# EAGLE design cell-voltage-amplifier (EAGLE 9.5.0)
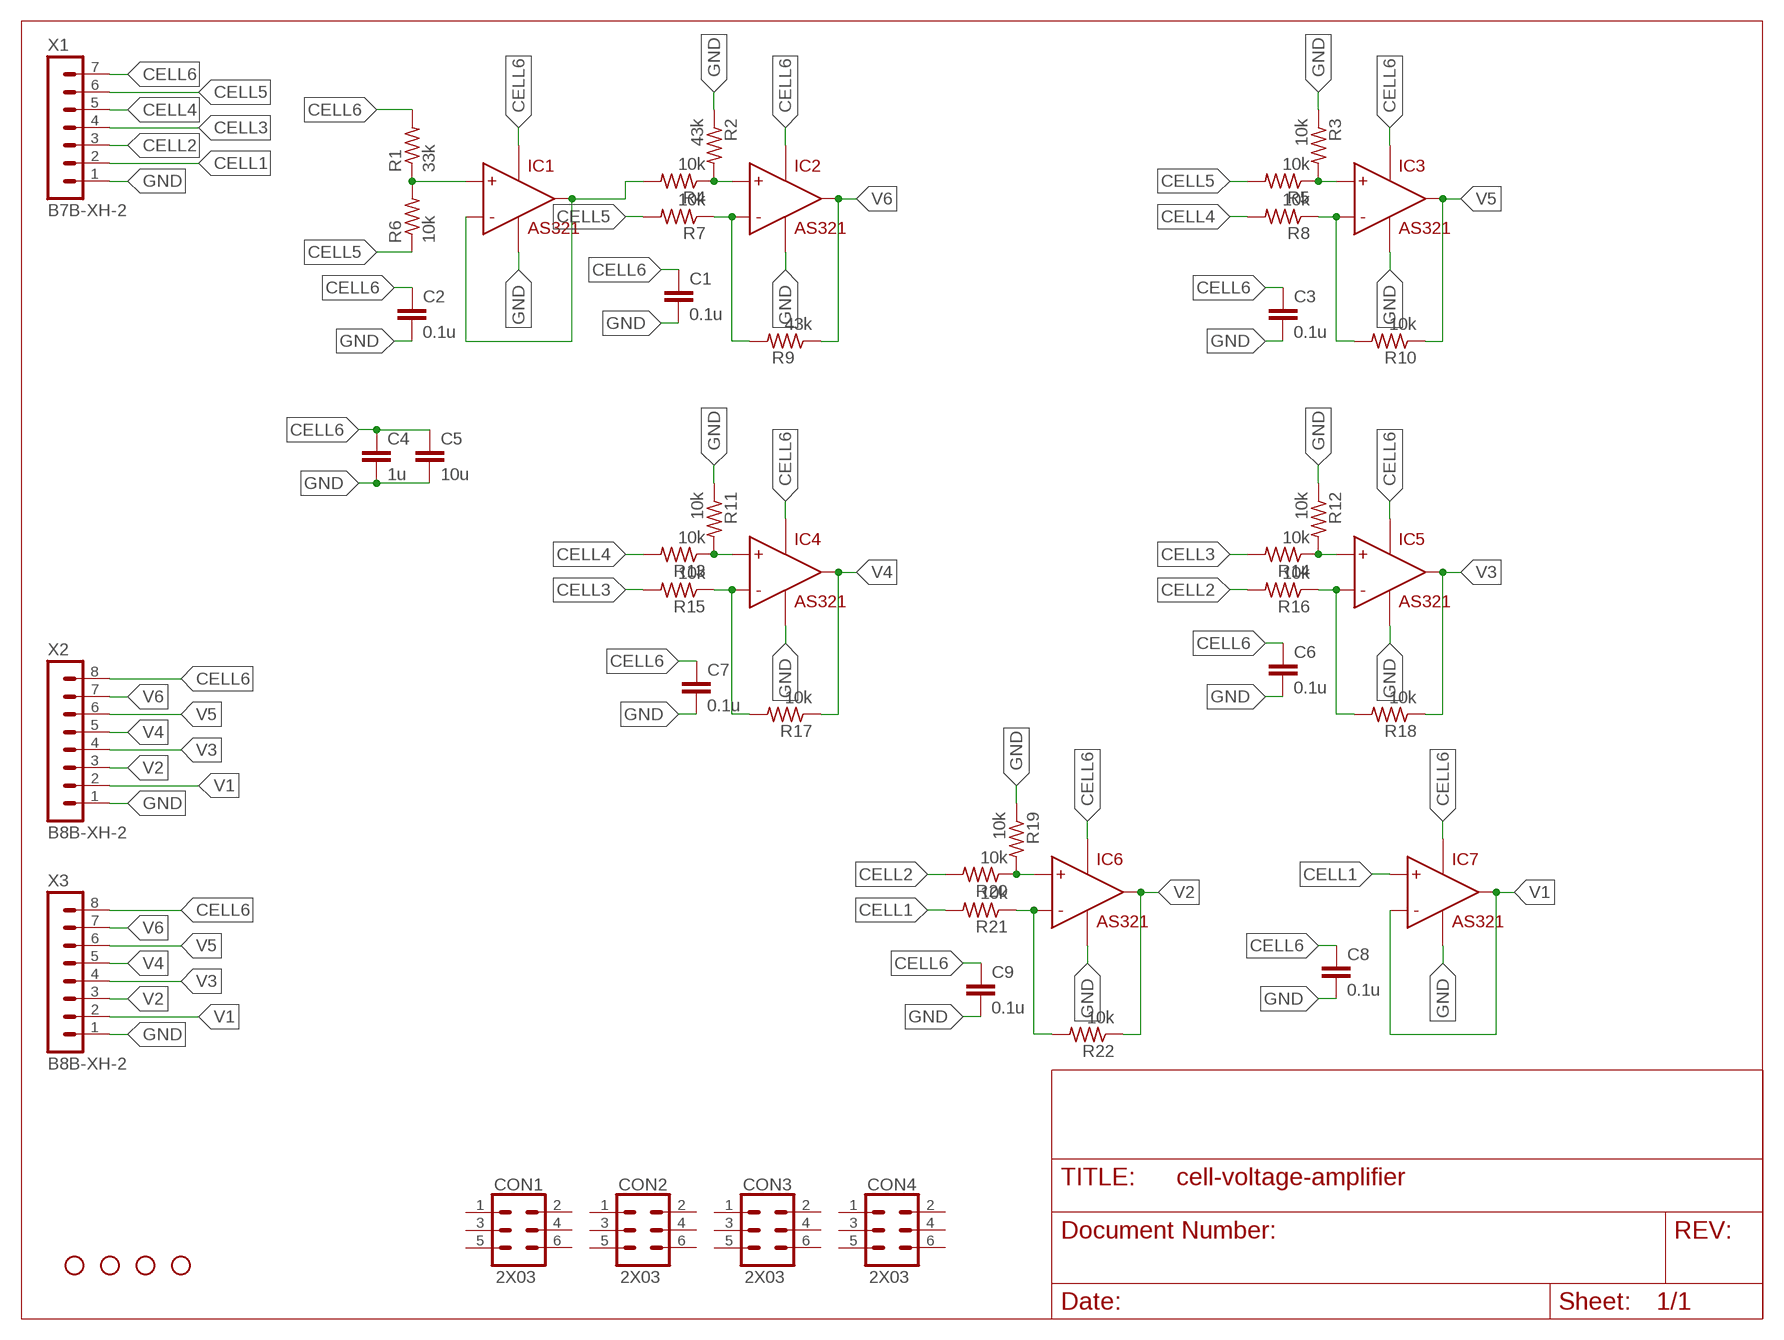
[diagram p0: schematic, sheet 1]

## Parts
C1  0.1u  CAPACITOR_0805  [0805]
C2  0.1u  CAPACITOR_0805  [0805]
C3  0.1u  CAPACITOR_0805  [0805]
C4  1u  CAPACITOR_0805  [0805]
C5  10u  CAPACITOR_0805  [0805]
C6  0.1u  CAPACITOR_0805  [0805]
C7  0.1u  CAPACITOR_0805  [0805]
C8  0.1u  CAPACITOR_0805  [0805]
C9  0.1u  CAPACITOR_0805  [0805]
CON1  2X03  [2X03]
CON2  2X03  [2X03]
CON3  2X03  [2X03]
CON4  2X03  [2X03]
H1  STAND-OFF  [STAND-OFF]
H2  STAND-OFF  [STAND-OFF]
H3  STAND-OFF  [STAND-OFF]
H4  STAND-OFF  [STAND-OFF]
IC1  AS321  [AS321]
IC2  AS321  [AS321]
IC3  AS321  [AS321]
IC4  AS321  [AS321]
IC5  AS321  [AS321]
IC6  AS321  [AS321]
IC7  AS321  [AS321]
R1  33k  R-US_R0805  [R0805]
R2  43k  R-US_R0805  [R0805]
R3  10k  R-US_R0805  [R0805]
R4  10k  R-US_R0805  [R0805]
R5  10k  R-US_R0805  [R0805]
R6  10k  R-US_R0805  [R0805]
R7  10k  R-US_R0805  [R0805]
R8  10k  R-US_R0805  [R0805]
R9  43k  R-US_R0805  [R0805]
R10  10k  R-US_R0805  [R0805]
R11  10k  R-US_R0805  [R0805]
R12  10k  R-US_R0805  [R0805]
R13  10k  R-US_R0805  [R0805]
R14  10k  R-US_R0805  [R0805]
R15  10k  R-US_R0805  [R0805]
R16  10k  R-US_R0805  [R0805]
R17  10k  R-US_R0805  [R0805]
R18  10k  R-US_R0805  [R0805]
R19  10k  R-US_R0805  [R0805]
R20  10k  R-US_R0805  [R0805]
R21  10k  R-US_R0805  [R0805]
R22  10k  R-US_R0805  [R0805]
X1  B7B-XH-2  [B7B-XH-A]
X2  B8B-XH-2  [B8B-XH-A]
X3  B8B-XH-2  [B8B-XH-A]

## Nets
CELL1: IC7.1(I+) R21.2 X1.2
CELL2: R16.2 R20.2 X1.3
CELL3: R14.2 R15.2 X1.4
CELL4: R8.2 R13.2 X1.5
CELL5: R5.2 R6.1 R7.2 X1.6
CELL6: C1.1 C2.1 C3.1 C4.1 C5.1 C6.1 C7.1 C8.1 C9.1 IC1.5(V+) IC2.5(V+) IC3.5(V+) IC4.5(V+) IC5.5(V+) IC6.5(V+) IC7.5(V+) R1.2 X1.7 X2.8 X3.8
GND: C1.2 C2.2 C3.2 C4.2 C5.2 C6.2 C7.2 C8.2 C9.2 IC1.2(V-) IC2.2(V-) IC3.2(V-) IC4.2(V-) IC5.2(V-) IC6.2(V-) IC7.2(V-) R2.1 R3.1 R11.1 R12.1 R19.1 X1.1 X2.1 X3.1
N$1: IC1.3(I-) IC1.4(OUT) R4.2
N$2: IC1.1(I+) R1.1 R6.2
N$3: IC2.1(I+) R2.2 R4.1
N$4: IC2.3(I-) R7.1 R9.2
N$6: IC4.1(I+) R11.2 R13.1
N$7: IC4.3(I-) R15.1 R17.2
N$8: IC3.1(I+) R3.2 R5.1
N$9: IC3.3(I-) R8.1 R10.2
N$12: IC5.1(I+) R12.2 R14.1
N$13: IC5.3(I-) R16.1 R18.2
N$15: IC6.1(I+) R19.2 R20.1
N$16: IC6.3(I-) R21.1 R22.2
V1: IC7.3(I-) IC7.4(OUT) X2.2 X3.2
V2: IC6.4(OUT) R22.1 X2.3 X3.3
V3: IC5.4(OUT) R18.1 X2.4 X3.4
V4: IC4.4(OUT) R17.1 X2.5 X3.5
V5: IC3.4(OUT) R10.1 X2.6 X3.6
V6: IC2.4(OUT) R9.1 X2.7 X3.7
Unconnected: CON1.1 CON1.2 CON1.3 CON1.4 CON1.5 CON1.6 CON2.1 CON2.2 CON2.3 CON2.4 CON2.5 CON2.6 CON3.1 CON3.2 CON3.3 CON3.4 CON3.5 CON3.6 CON4.1 CON4.2 CON4.3 CON4.4 CON4.5 CON4.6

## Library data of the parts
C1-C9 = EcoCar-Passives:CAPACITOR_0805
CON1-CON4 = EcoCar-Connectors-2.54mm:2X03: 2.54mm (0.1") Header
H1-H4 = EcoCar-Miscellaneous:STAND-OFF: Stand Off Drill holes for mechanically mounting via screws, standoffs, etc. Note: Use the keepout ring to avoid running the screw head into surrounding components. Variant Overviews STAND-OFF - Mechanical footprint for a #4 phillips button head screw. STAND-OFF-TIGHT - Mechanical footprint for a #4 phillips button head screw, Example SparkFun Products Screw - Phillips Head (1/4", 4-40, 10 pack) <https://www.sparkfun.com/products/10453> (PRT-10453) Screw - Phillips Head (1/2", 4-40, 10 pack) <https://www.sparkfun.com/products/10452> (PRT-10452) Screw - Phillips Head (3/4", 4-40, 10 pack) <https://www.sparkfun.com/products/10451> (PRT-10451) Screw - Phillips Head (1", 4-40, 10 pack) <https://www.sparkfun.com/products/10450> (PRT-10450)
IC1-IC7 = AS321:AS321: Digikey PArt #: AS321KTR-E1
R1-R22 = rcl:R-US_: RESISTOR, American symbol; SPICEPREFIX: R
X1 = con-JST:B7B-XH: JST XH series header 2.50mm pitch disconnectable crimp style connectors, vertical (side entry type), 7 pins
X2 X3 = con-JST:B8B-XH: JST XH series header 2.50mm pitch disconnectable crimp style connectors, vertical (side entry type), 8 pins

## Board
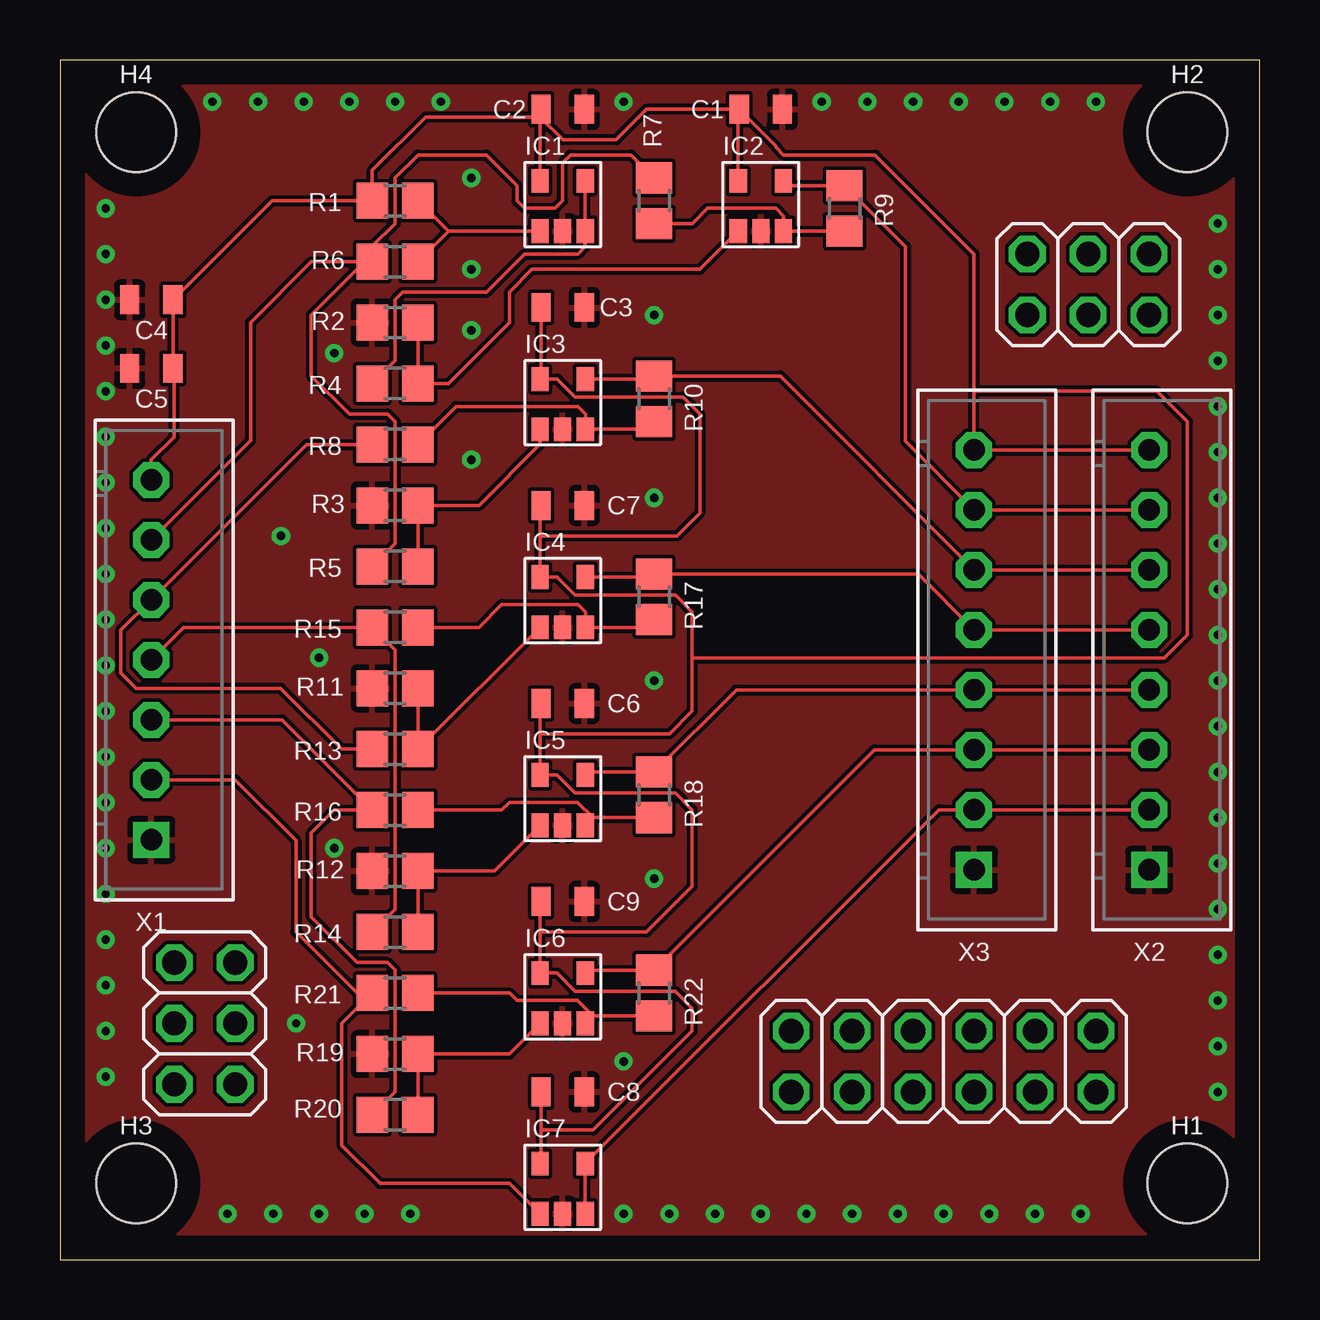
[diagram p1: board, top side]
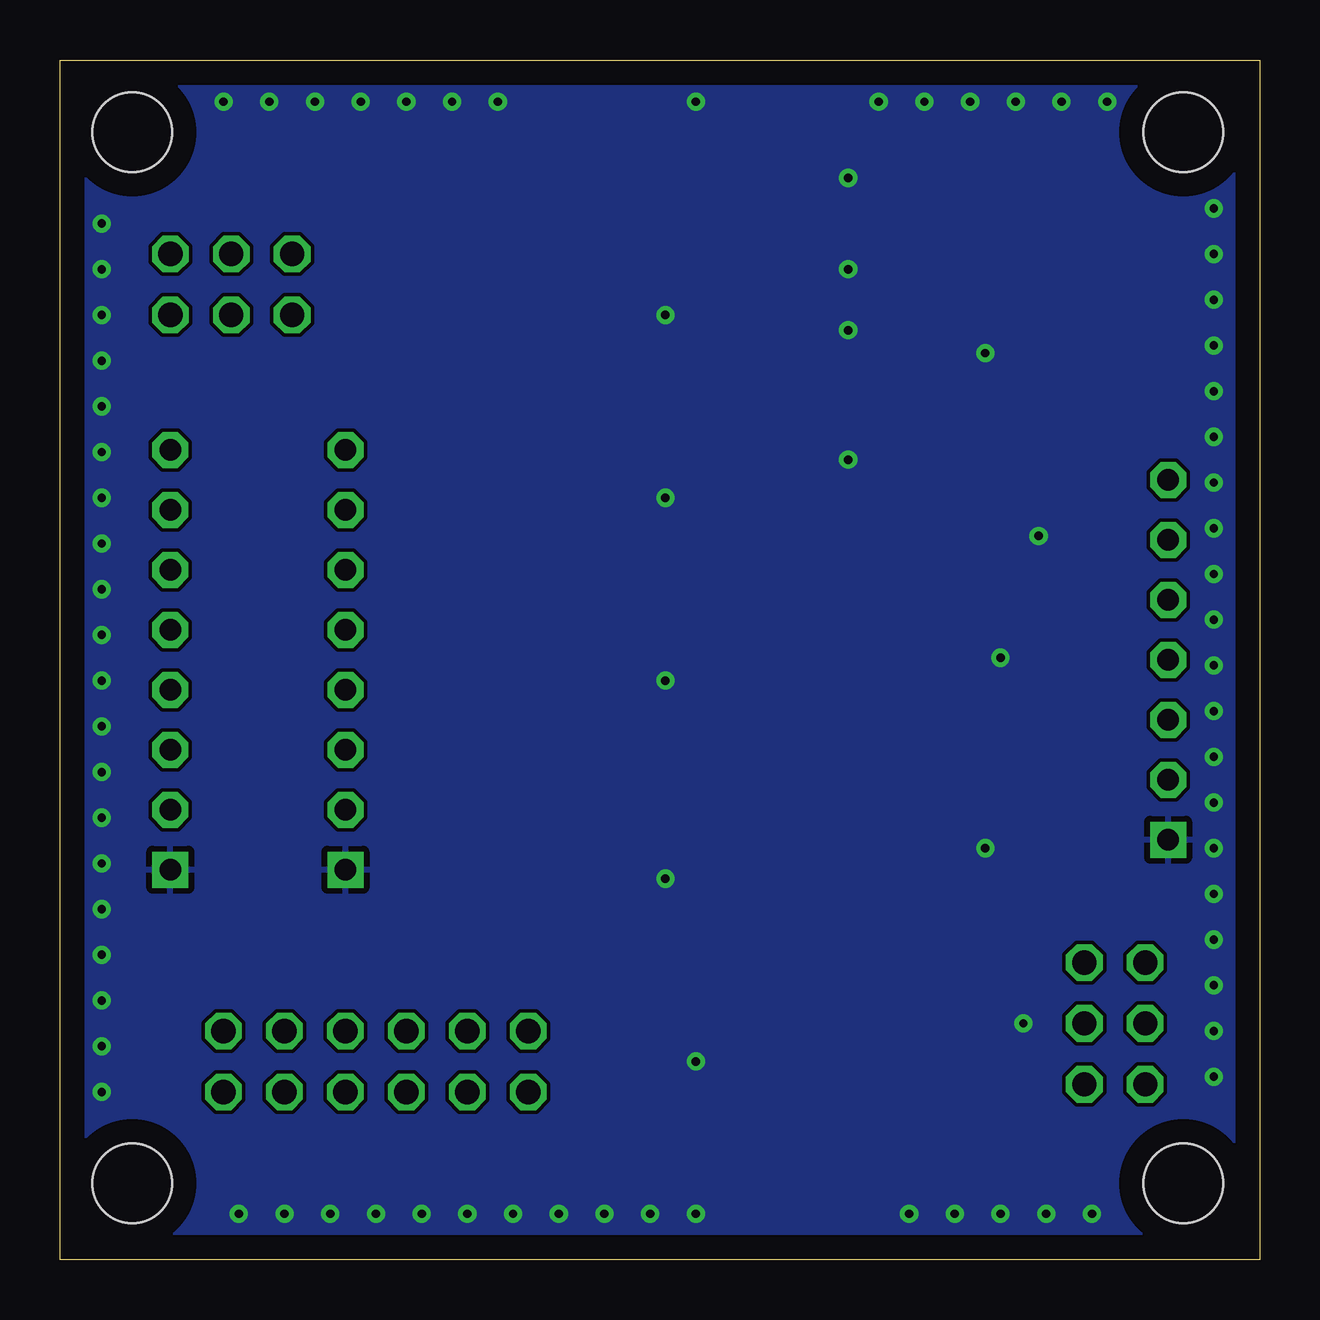
[diagram p2: board, bottom side, seen from below]

Size 50 x 50 mm. Coordinates in mm from the lower left corner, seen from the top.
Outline: 0,0 50,0 50,50 0,50 0,0
Copper layers (1*16): Top 0.035mm / dielectric 1.5mm / Bottom 0.035mm
Design rules "default": minimum track width 6mil, minimum drill 0.35mm, track to track 6mil, track to pad 6mil, pad to pad 6mil, via to via 6mil, smd to smd 6mil, copper to edge 40mil, drill to drill 6mil, minimum pad ring 10mil, minimum via ring 8mil, stop-mask expansion 4mil, vias tented up to drill 0mil, thermal gap 10mil

### Footprints (pad centres in the part's own frame; a part is rotated, then mirrored left to right if it is on the bottom)
0805 = smd 0.8 x 1.2: 1 -0.9,0; 2 0.9,0
2X03 = drill 1.016 octagon: 1 -2.54,-1.27; 2 -2.54,1.27; 3 0,-1.27; 4 0,1.27; 5 2.54,-1.27; 6 2.54,1.27
STAND-OFF = hole 3.302: 0,0
AS321 = smd 0.711 x 0.991: 1 -0.94,0; 2 0,0; 3 0.94,0; 4 0.94,2.095; 5 -0.94,2.095
R0805 = smd 1.3 x 1.5: 1 -0.95,0; 2 0.95,0
B7B-XH-A = drill 0.9 pad 1.5 square: 1 7.5,0 | drill 0.9 pad 1.5 octagon: 2 5,0; 3 2.5,0; 4 0,0; 5 -2.5,0; 6 -5,0; 7 -7.5,0
B8B-XH-A = drill 0.9 pad 1.5 square: 1 8.75,0 | drill 0.9 pad 1.5 octagon: 2 6.25,0; 3 3.75,0; 4 1.25,0; 5 -1.25,0; 6 -3.75,0; 7 -6.25,0; 8 -8.75,0

### Placement (x,y rotation side)
C1  29.21,47.94 0 top
C2  20.95,47.94 0 top
C3  20.95,39.69 0 top
C4  3.81,40.01 180 top
C5  3.81,37.15 180 top
C6  20.95,23.18 0 top
C7  20.95,31.43 0 top
C8  20.95,6.99 0 top
C9  20.95,14.92 0 top
CON1  40.64,8.26 0 top
CON2  33.02,8.26 0 top
CON3  6.03,9.84 90 top
CON4  42.86,40.64 0 top
H1  46.99,3.17 0 top
H2  46.99,46.99 0 top
H3  3.17,3.17 0 top
H4  3.17,46.99 0 top
IC1  20.95,42.86 0 top
IC2  29.21,42.86 0 top
IC3  20.95,34.61 0 top
IC4  20.95,26.35 0 top
IC5  20.95,18.1 0 top
IC6  20.95,9.84 0 top
IC7  20.95,1.91 0 top
R1  13.97,44.13 180 top
R2  13.97,39.05 0 top
R3  13.97,31.43 0 top
R4  13.97,36.51 180 top
R5  13.97,28.89 180 top
R6  13.97,41.59 0 top
R7  24.77,44.13 90 top
R8  13.97,33.97 180 top
R9  32.7,43.81 270 top
R10  24.77,35.88 270 top
R11  13.97,23.81 0 top
R12  13.97,16.19 0 top
R13  13.97,21.27 180 top
R14  13.97,13.65 180 top
R15  13.97,26.35 180 top
R16  13.97,18.73 180 top
R17  24.77,27.62 270 top
R18  24.77,19.37 270 top
R19  13.97,8.57 0 top
R20  13.97,6.03 180 top
R21  13.97,11.11 180 top
R22  24.77,11.11 270 top
X1  3.81,25 270 top
X2  45.4,25 270 top
X3  38.1,25 270 top

### Tracks (layer width: path | path; a pad name or v marks a point on that pad's centre or on a via)
CELL1
  Top 0.152: X1.2 7.3,20 9.84,17.46 9.84,13.65 12.38,11.11 R21.2 11.75,9.84 11.75,4.76 13.34,3.17 18.75,3.17 IC7.1
CELL2
  Top 0.152: X1.3 9.25,22.5 R16.2 11.43,18.73 10.48,17.78 10.48,14.29 12.38,12.38 13.65,12.38 13.97,12.06 13.97,6.98 R20.2
CELL3
  Top 0.152: X1.4 5.16,26.35 R15.2 13.97,25.4 13.97,14.6 R14.2
CELL4
  Top 0.152: R8.2 10.28,33.97 3.87,27.56 X1.5 2.54,26.23 2.54,24.45 3.17,23.81 9.21,23.81 11.75,21.27 R13.2
CELL5
  Top 0.152: R6.1 13.02,41.27 12.38,41.27 10.48,39.37 10.48,36.83 12.06,35.24 13.65,35.24 13.97,34.92 13.97,29.84 R5.2 | X1.6 7.94,34.13 7.94,39.05 10.48,41.59 R6.1 | R6.1 13.02,42.23 13.97,43.18 13.97,45.09 14.92,46.04 17.78,46.04 19.05,44.77 19.05,44.13 19.37,43.81 20.64,43.81 20.95,44.13 20.95,45.72 21.27,46.04 23.81,46.04 R7.2
CELL6
  Top 0.152: X1.7 3.81,33.34 4.76,34.29 4.76,37.09 C5.1 C4.1 8.84,44.13 R1.2 13.02,45.4 15.24,47.62 19.74,47.62 C2.1 20.02,47.9 20.02,47.62 | IC1.5 20.02,47.62 | 20.02,30.16 IC4.5 20.72,28.45 21.48,27.69 25.65,27.69 26.35,26.99 26.35,25.08 | 20.02,30.16 20.02,31.39 C7.1 | 20.02,21.91 IC5.5 20.72,20.19 21.48,19.44 25.65,19.44 26.35,18.73 26.35,15.56 24.45,13.65 20.02,13.65 | 20.02,21.91 20.02,23.14 C6.1 | 20.02,13.65 IC6.5 20.72,11.94 21.48,11.18 25.65,11.18 26.35,10.48 26.35,9.53 22.23,5.4 20.05,5.4 | 20.02,13.65 20.02,14.88 C9.1 | C8.1 20.05,5.4 | 20.05,5.4 20.05,4.04 IC7.5 | IC2.5 28.27,47.9 C1.1 | X2.8 X3.8 38.1,36.2 | C1.1 29.84,46.41 29.84,46.35 30.16,46.04 33.97,46.04 38.1,41.91 38.1,36.2 | C1.1 24.45,47.94 23.18,46.67 20.97,46.67 20.02,47.62 | 20.02,30.16 25.72,30.16 26.67,31.11 26.67,35.24 25.96,35.95 21.48,35.95 20.72,36.7 IC3.5 20.05,36.74 C3.1 | 26.35,25.08 26.35,22.86 25.4,21.91 20.02,21.91 | 26.35,25.08 46.04,25.08 46.99,26.04 46.99,34.92 45.72,36.2 38.1,36.2
GND  (via drill 0.35)
  other vias: 6.99,1.91 8.89,1.91 10.79,1.91 12.7,1.91 14.61,1.91 23.5,1.91 25.4,1.91 27.3,1.91 29.21,1.91 31.11,1.91 33.02,1.91 34.92,1.91 36.83,1.91 38.73,1.91 40.64,1.91 42.55,1.91 48.26,6.99 48.26,8.89 48.26,10.79 48.26,12.7 48.26,14.61 48.26,16.51 48.26,18.41 48.26,20.32 48.26,22.23 48.26,24.13 48.26,26.04 48.26,27.94 48.26,29.84 48.26,31.75 48.26,33.66 48.26,35.56 48.26,37.47 48.26,39.37 48.26,41.27 48.26,43.18 43.18,48.26 41.27,48.26 39.37,48.26 37.47,48.26 35.56,48.26 33.66,48.26 31.75,48.26 23.5,48.26 15.88,48.26 13.97,48.26 12.06,48.26 10.16,48.26 8.26,48.26 6.35,48.26 1.91,43.81 1.91,41.91 1.91,40.01 1.91,38.1 1.91,36.2 1.91,34.29 1.91,32.38 1.91,30.48 1.91,28.57 1.91,26.67 1.91,24.77 1.91,22.86 1.91,20.95 1.91,19.05 1.91,17.14 1.91,15.24 1.91,13.34 1.91,11.43 1.91,9.53 1.91,7.62 17.14,33.34 24.77,31.75 24.77,24.13 24.77,15.88 23.5,8.26 9.84,9.84 11.43,17.14 17.14,38.73 24.77,39.37 17.14,45.09 17.14,41.27 10.79,25.08 9.21,30.16 11.43,37.78
  pour Top: -5.71,55.88 54.61,55.88 54.61,-3.81 -5.71,-3.81
  pour Bottom: -2.54,53.34 52.39,53.34 52.39,41.91 52.39,-1.59 48.58,-1.59 -2.54,-1.59
N$1
  Top 0.152: IC1.4 IC1.3 21.89,42.22 21.59,41.91 19.37,41.91 17.78,40.32 14.29,40.32 13.97,40.01 13.97,37.46 R4.2
N$2
  Top 0.152: IC1.1 16.19,42.86 | 16.19,42.86 R1.1 | R6.2 16.19,42.86
N$3
  Top 0.152: IC2.1 26.68,41.27 19.68,41.27 18.73,40.32 18.73,39.05 16.19,36.51 R4.1 R2.2
N$4
  Top 0.152: R7.1 26.36,43.18 26.99,43.81 29.84,43.81 30.16,43.5 30.16,42.88 IC2.3 R9.2
N$6
  Top 0.152: R13.1 | R13.1 20,26.35 IC4.1 | R11.2 R13.1
N$7
  Top 0.152: IC4.3 21.91,26.35 | 21.91,26.35 24.45,26.35 R17.2 | 21.91,26.35 21.91,26.99 21.59,27.3 18.41,27.3 17.46,26.35 R15.1
N$8
  Top 0.152: R5.1 R3.2 17.46,31.43 20.02,33.98 IC3.1
N$9
  Top 0.152: IC3.3 21.91,34.61 | 21.91,34.61 24.45,34.61 R10.2 | 21.91,34.61 21.91,35.24 21.59,35.56 16.51,35.56 R8.1
N$12
  Top 0.152: R14.1 R12.2 18.11,16.19 IC5.1
N$13
  Top 0.152: IC5.3 22.21,18.42 | 22.21,18.42 R18.2 | R16.1 18.41,18.73 18.73,19.05 21.58,19.05 22.21,18.42
N$15
  Top 0.152: R20.1 R19.2 18.75,8.57 IC6.1
N$16
  Top 0.152: IC6.3 22.21,10.16 | 22.21,10.16 R22.2 | R21.1 18.73,11.11 19.05,10.79 21.58,10.79 22.21,10.16
V1
  Top 0.152: IC7.3 IC7.4 36.64,18.75 X3.2 X2.2
V2
  Top 0.152: IC6.4 22.02,12.06 R22.1 33.95,21.25 X3.3 X2.3
V3
  Top 0.152: IC5.4 22.02,20.32 R18.1 28.2,23.75 X3.4 X2.4
V4
  Top 0.152: IC4.4 24.64,28.45 R17.1 35.78,28.57 X3.5 X2.5
V5
  Top 0.152: IC3.4 24.96,36.7 25.08,36.83 R10.1 30.02,36.83 X3.6 X2.6
V6
  Top 0.152: IC2.4 30.34,44.77 R9.1 35.24,42.23 35.24,34.11 X3.7 X2.7